# Altium schematic sheet INPUT.SchDoc
size A4; SheetNumber: 2; SheetTotal: 4
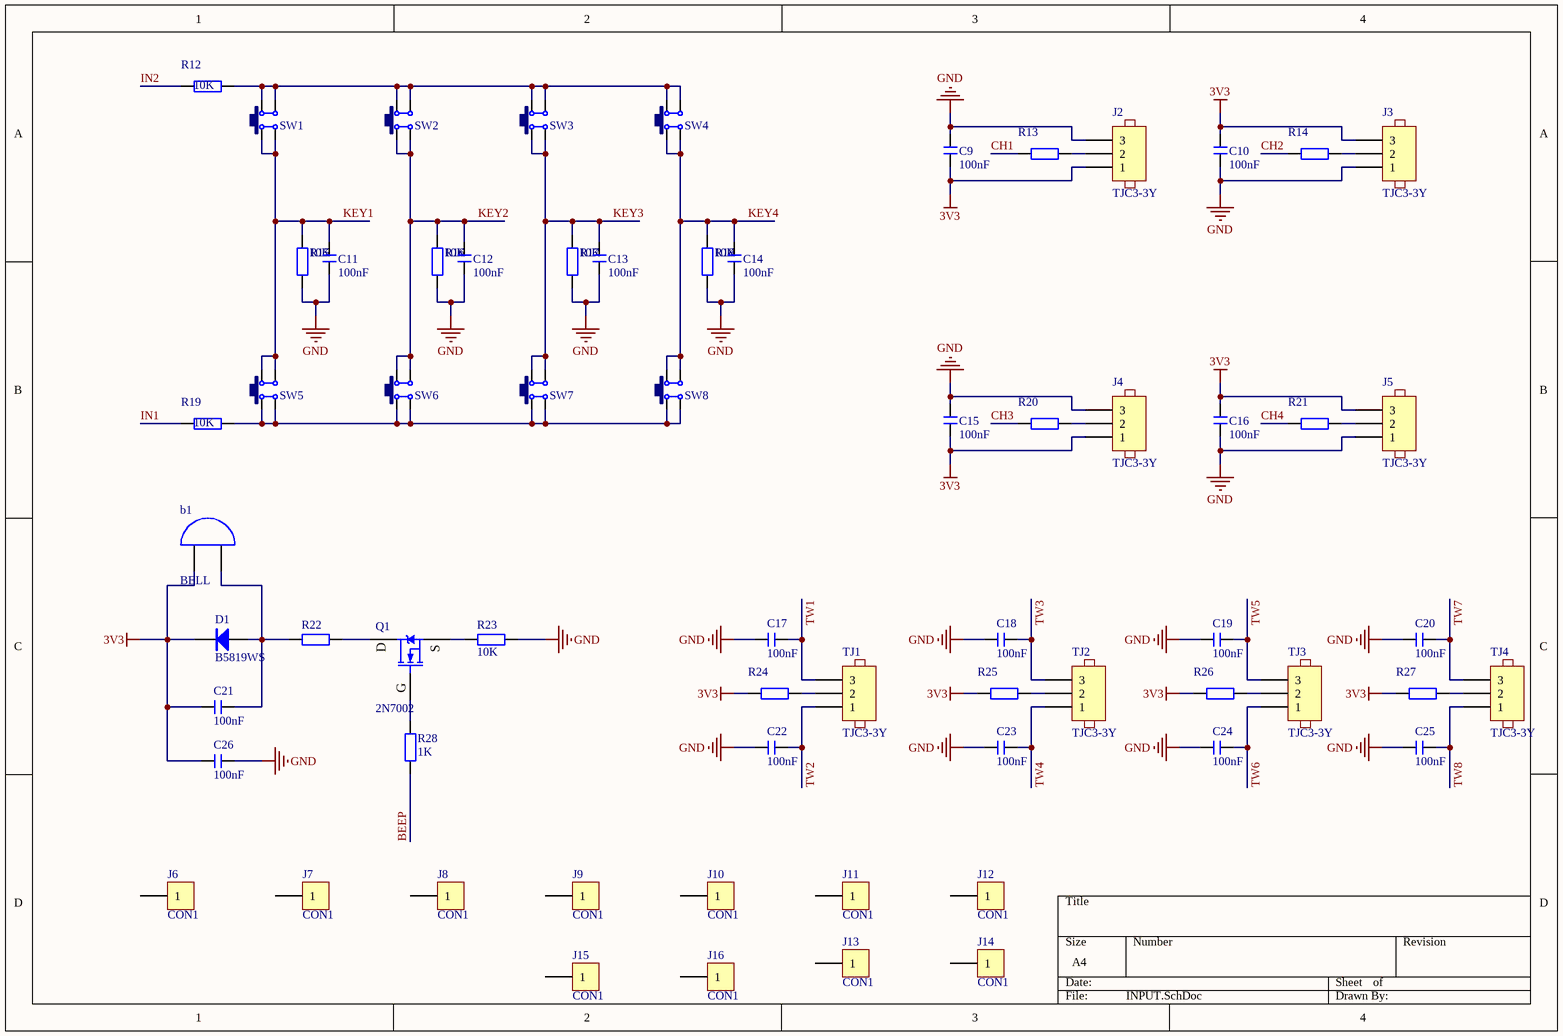
[diagram p0: INPUT.SchDoc]

## Parts
b1  BELL  [BEEP 5x9x5.5]
C9  100nF  [C 0603_L]
C10  100nF  [C 0603_L]
C11  100nF  [C 0603_L]
C12  100nF  [C 0603_L]
C13  100nF  [C 0603_L]
C14  100nF  [C 0603_L]
C15  100nF  [C 0603_L]
C16  100nF  [C 0603_L]
C17  100nF  [C 0603_L]
C18  100nF  [C 0603_L]
C19  100nF  [C 0603_L]
C20  100nF  [C 0603_L]
C21  100nF  [C 0603_L]
C22  100nF  [C 0603_L]
C23  100nF  [C 0603_L]
C24  100nF  [C 0603_L]
C25  100nF  [C 0603_L]
C26  100nF  [C 0603_L]
D1  B5819WS  [SOD-323]
J2  TJC3-3Y  [MX 1.25-LS-3P]
J3  TJC3-3Y  [MX 1.25-LS-3P]
J4  TJC3-3Y  [MX 1.25-LS-3P]
J5  TJC3-3Y  [MX 1.25-LS-3P]
J6  CON1  [M3x5+6_L]
J7  CON1  [M3x5+6_L]
J8  CON1  [M3x5+6_L]
J9  CON1  [M3x5+6_L]
J10  CON1  [M3x5+6_L]
J11  CON1  [M3x5+6_L]
J12  CON1  [M3x5+6_L]
J13  CON1  [M3x5+6_L]
J14  CON1  [M3x5+6_L]
J15  CON1  [M3x5+6_L]
J16  CON1  [M3x5+6_L]
Q1  2N7002  [SOT-23]
R12  10K  [R 0603_L]
R13  (no value)  [R 0603_L]
R14  (no value)  [R 0603_L]
R15  10K  [R 0603_L]
R16  10K  [R 0603_L]
R17  10K  [R 0603_L]
R18  10K  [R 0603_L]
R19  10K  [R 0603_L]
R20  (no value)  [R 0603_L]
R21  (no value)  [R 0603_L]
R22  (no value)  [R 0603_L]
R23  10K  [R 0603_L]
R24  (no value)  [R 0603_L]
R25  (no value)  [R 0603_L]
R26  (no value)  [R 0603_L]
R27  (no value)  [R 0603_L]
R28  1K  [R 0603_L]
SW1  6x6x5  [TSW SMD-6*6*5-L]  (value not drawn)
SW2  6x6x5  [TSW SMD-6*6*5-L]  (value not drawn)
SW3  6x6x5  [TSW SMD-6*6*5-L]  (value not drawn)
SW4  6x6x5  [TSW SMD-6*6*5-L]  (value not drawn)
SW5  6x6x5  [TSW SMD-6*6*5-L]  (value not drawn)
SW6  6x6x5  [TSW SMD-6*6*5-L]  (value not drawn)
SW7  6x6x5  [TSW SMD-6*6*5-L]  (value not drawn)
SW8  6x6x5  [TSW SMD-6*6*5-L]  (value not drawn)
TJ1  TJC3-3Y  [MX 1.25-LS-3P]
TJ2  TJC3-3Y  [MX 1.25-LS-3P]
TJ3  TJC3-3Y  [MX 1.25-LS-3P]
TJ4  TJC3-3Y  [MX 1.25-LS-3P]

## Nets
3V3: b1.1 C9.1 C10.2 C15.1 C16.2 C21.2 C26.2 D1.2(K) J2.1 J3.3 J4.1 J5.3 R24.2 R25.2 R26.2 R27.2
GND: C9.2 C10.1 C11.1 C12.1 C13.1 C14.1 C15.2 C16.1 C17.2 C18.2 C19.2 C20.2 C22.2 C23.2 C24.2 C25.2 C26.1 J2.3 J3.1 J4.3 J5.1 R15.2 R16.2 R17.2 R18.2 R23.1
BEEP: R28.1
CH1: R13.2
CH2: R14.2
CH3: R20.2
CH4: R21.2
IN1: R19.2
IN2: R12.2
KEY1: C11.2 R15.1 SW1.1 SW1.4 SW5.2 SW5.3
KEY2: C12.2 R16.1 SW2.1 SW2.4 SW6.2 SW6.3
KEY3: C13.2 R17.1 SW3.1 SW3.4 SW7.2 SW7.3
KEY4: C14.2 R18.1 SW4.1 SW4.4 SW8.2 SW8.3
TW1: C17.1 TJ1.3
TW2: C22.1 TJ1.1
TW3: C18.1 TJ2.3
TW4: C23.1 TJ2.1
TW5: C19.1 TJ3.3
TW6: C24.1 TJ3.1
TW7: C20.1 TJ4.3
TW8: C25.1 TJ4.1
Netb1_2: b1.2 C21.1 D1.1(A) R22.1
NetJ2_2: J2.2 R13.1
NetJ3_2: J3.2 R14.1
NetJ4_2: J4.2 R20.1
NetJ5_2: J5.2 R21.1
NetQ1_1: Q1.1(G) R28.2
NetQ1_2: Q1.2(D) R22.2
NetQ1_3: Q1.3(S) R23.2
NetR12_1: R12.1 SW1.2 SW1.3 SW2.2 SW2.3 SW3.2 SW3.3 SW4.2 SW4.3
NetR19_1: R19.1 SW5.1 SW5.4 SW6.1 SW6.4 SW7.1 SW7.4 SW8.1 SW8.4
NetR24_1: R24.1 TJ1.2
NetR25_1: R25.1 TJ2.2
NetR26_1: R26.1 TJ3.2
NetR27_1: R27.1 TJ4.2

Not connected (* = marked no-connect by the designer): J6 1; J7 1; J8 1; J9 1; J10 1; J11 1; J12 1; J13 1; J14 1; J15 1; J16 1

## Library data of the parts
C9-C26 = C: 无极性贴片电容; 版权归属: 源创客; BOM名称: 无极性贴片电容; 学习资源: www.ooocke.com
D1 = SR540: 肖特基二极管                           电压:40V 电流:1A                 C7420331; BOM名称: 整流二极管; 版权归属: 源创客; 属性: 40V  5A; 学习资源: www.ooocke.com
J2-J5 TJ1-TJ4 = TJC3-3Y: HCZZ0015-3             C7433469; Set Position: 0.5; Published: 8-Jun-2000; LatestRevisionDate: 17-Jul-2002; LatestRevisionNote: Re-released for DXP Platform.; PackageReference: AXIAL-0.6; Publisher: Altium Limited
Q1 = IRF840: N沟场效应管; pin to pad: 2>3 3>2; 版权归属: 源创客; BOM名称: N沟场效应管; 学习资源: www.ooocke.com
R12-R28 = R: 贴片电阻; 版权归属: 源创客; BOM名称: 贴片电阻; 学习资源: www.ooocke.com
SW1-SW8 = TSW SMD-6x6: KH-6X6X5H-STM     C2837531; pin to pad: 3>0 4>0; BOM名称: 贴片6x6轻触开关; 版权归属: 源创客; 学习资源: www.ooocke.com